# Altium schematic sheet USB.SchDoc
size A3; PageSetup: Record=PageOptions|CenterHorizontal=True|CenterVertical=True|PrintScale=1.00|XCorrection=1.00|YCorrection=1.00|PrintKind=0|BorderSize=5000000|LeftOffset=0|BottomOffset=0|Orientation=2|PaperLength=1000|PaperWidth=1000|Scale=100|PaperSource=7|PrintQuality=-4|MediaType=1|DitherType=10|PaperKind=A4|PrintScaleMode=1; Organization: Electronic Research & Design; Address1: 11 Granofier; Address2: Zwartkop; Address3: Centurion; Address4: South Africa
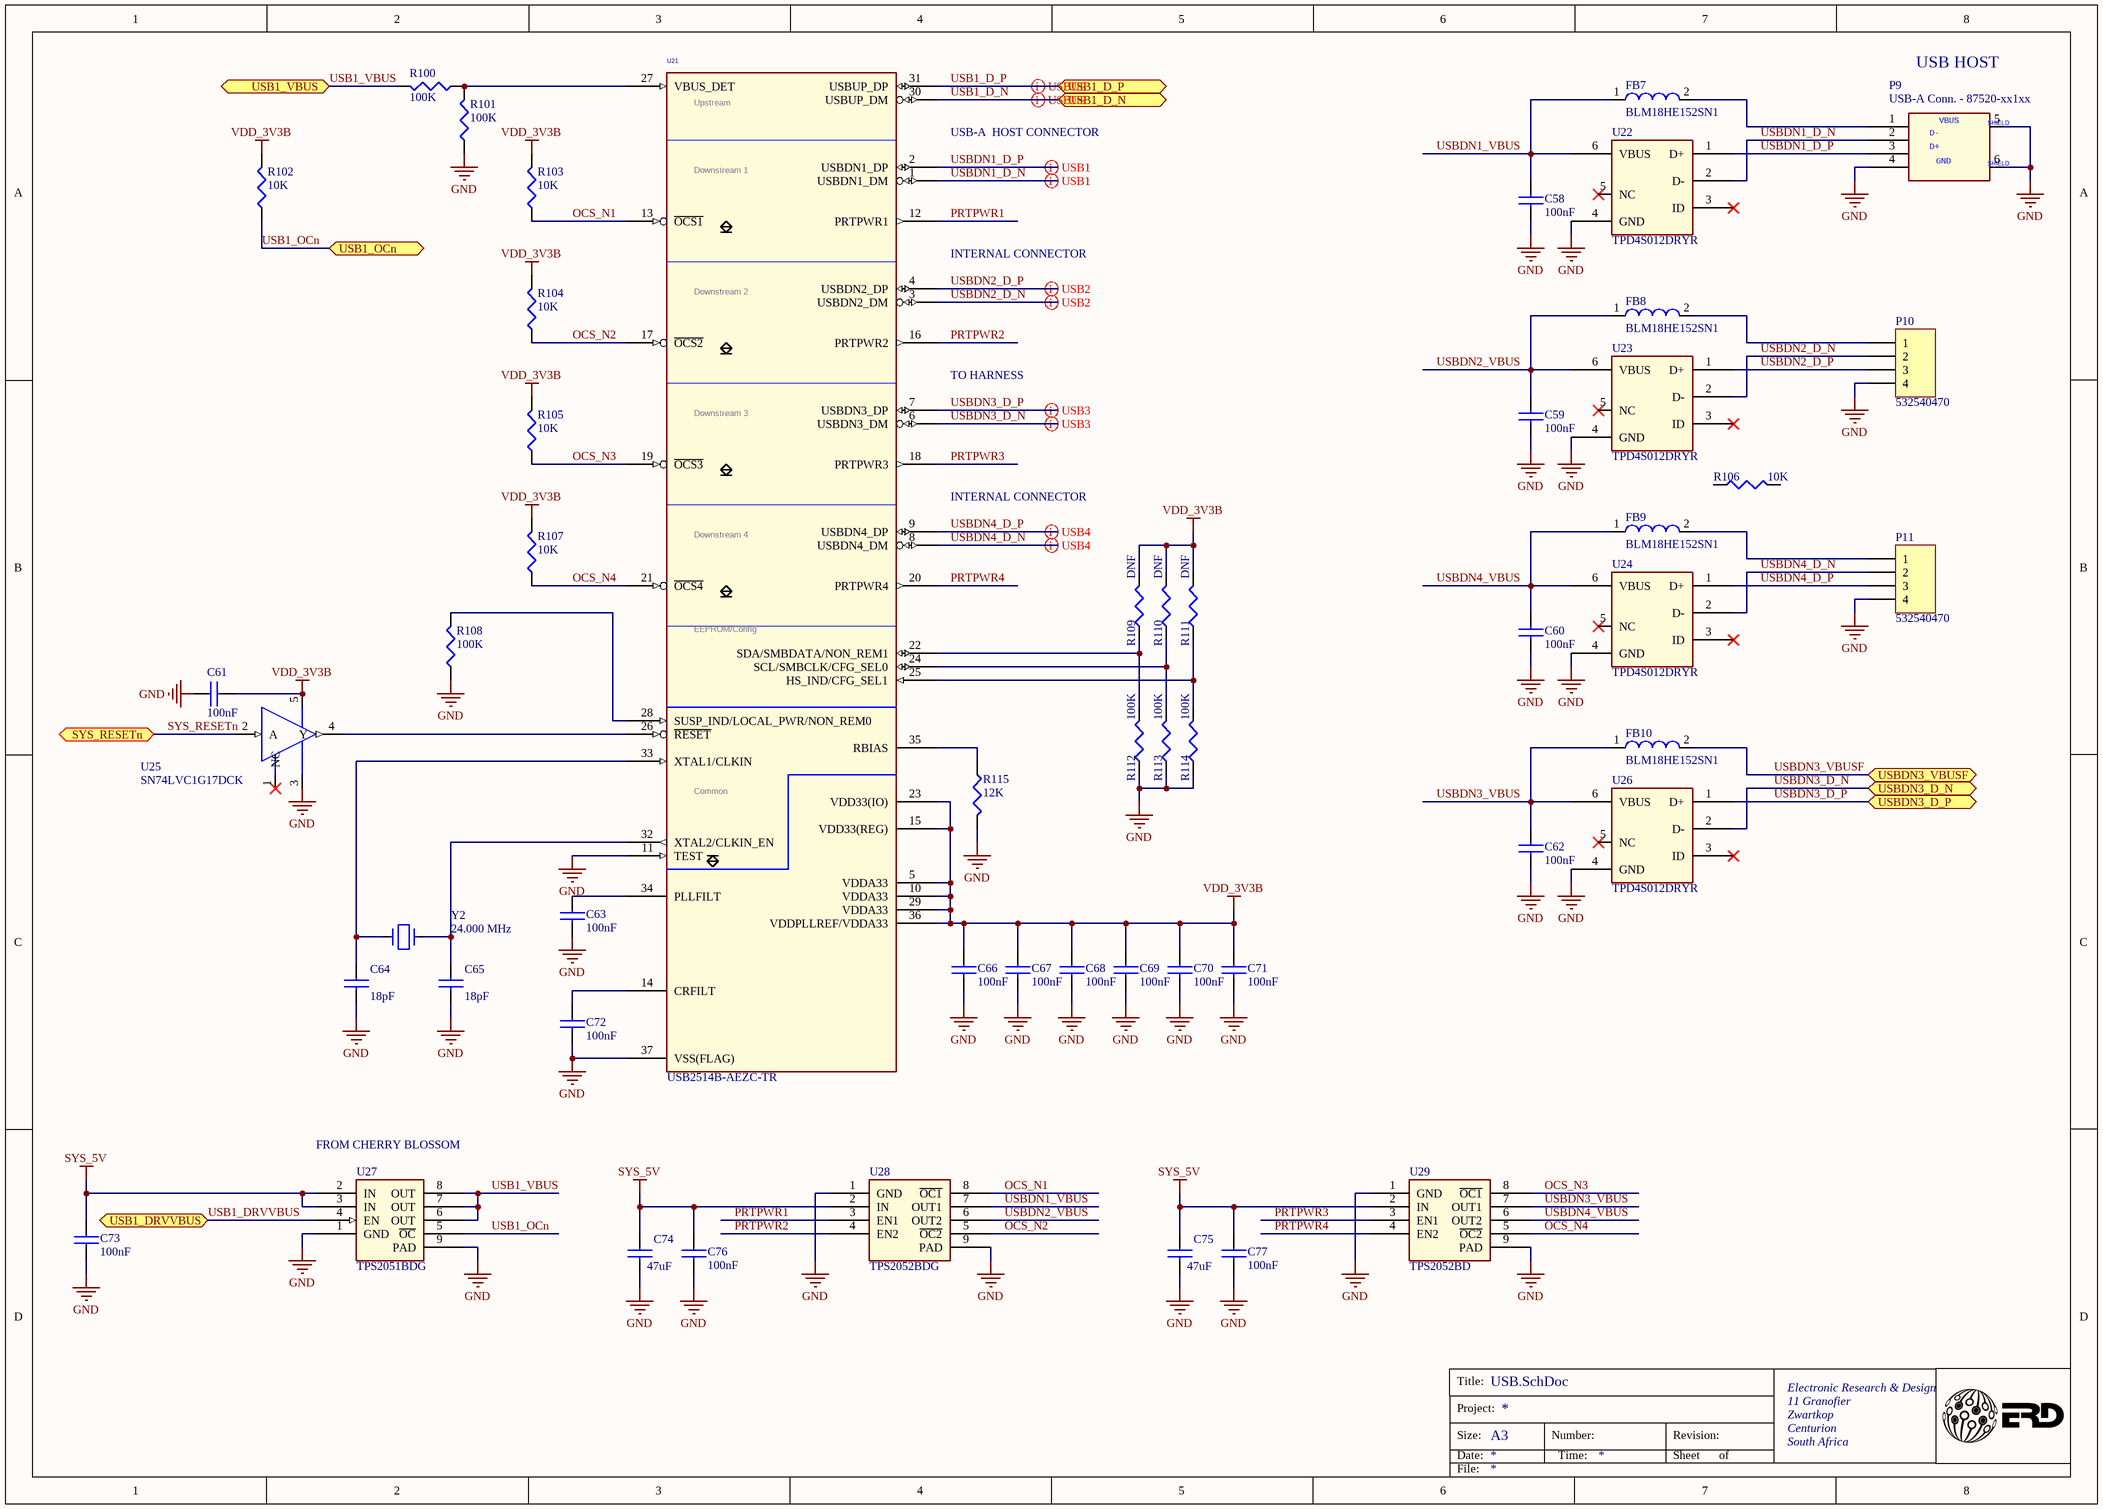
[diagram p0: USB.SchDoc]

## Parts
C58  100nF  [CC0402]
C59  100nF  [CC0402]
C60  100nF  [CC0402]
C61  100nF  [CC0402]
C62  100nF  [CC0402]
C63  100nF  [CC0402]
C64  18pF  [CC0402]
C65  18pF  [CC0402]
C66  100nF  [CC0402]
C67  100nF  [CC0402]
C68  100nF  [CC0402]
C69  100nF  [CC0402]
C70  100nF  [CC0402]
C71  100nF  [CC0402]
C72  100nF  [CC0402]
C73  100nF  [CC0402]
C74  47uF  [RC1206]
C75  47uF  [RC1206]
C76  100nF  [CC0402]
C77  100nF  [CC0402]
FB7  BLM18HE152SN1  [LC0603]
FB8  BLM18HE152SN1  [LC0603]
FB9  BLM18HE152SN1  [LC0603]
FB10  BLM18HE152SN1  [LC0603]
P9  USB-A Conn. - 87520-xx1xx  [usb_a_sh]
P10  532540470  [HDR1X4]
P11  532540470  [HDR1X4]
R100  100K  [RC0402]
R101  100K  [RC0402]
R102  10K  [RC0402]
R103  10K  [RC0402]
R104  10K  [RC0402]
R105  10K  [RC0402]
R106  10K  [RC0402]
R107  10K  [RC0402]
R108  100K  [RC0402]
R109  DNF  [RC0402]
R110  DNF  [RC0402]
R111  DNF  [RC0402]
R112  100K  [RC0402]
R113  100K  [RC0402]
R114  100K  [RC0402]
R115  12K  [RC0402]
U21  USB2514B-AEZC-TR  [SQFN-36]
U22  TPD4S012DRYR  [U_6_DRY]
U23  TPD4S012DRYR  [U_6_DRY]
U24  TPD4S012DRYR  [U_6_DRY]
U25  SN74LVC1G17DCK  [DCK5_2P15X1P4]
U26  TPD4S012DRYR  [U_6_DRY]
U27  TPS2051BDG  [DGN-16X60]
U28  TPS2052BDG  [DGN-16X60]
U29  TPS2052BD  [DGN-16X60]
Y2  24.000 MHz  [XTAL150SMD_125X196]

## Ports
SYS_RESETn, USB1_D_N, USB1_D_P, USB1_DRVVBUS, USB1_OCn, USB1_VBUS, USBDN3_D_N, USBDN3_D_P, USBDN3_VBUSF

## Nets
GND: C58.2 C59.2 C60.2 C61.1 C62.2 C63.2 C64.2 C65.2 C66.2 C67.2 C68.2 C69.2 C70.2 C71.2 C72.2 C73.2 C74.2 C75.2 C76.2 C77.2 P9.4(P4) P9.5(SHELD1) P9.6(PAD4) P10.4 P11.4 R101.1 R108.1 R112.1 R113.1 R114.1 R115.2 U21.11(TEST) U21.37(VSS(FLAG)) U22.4(GND) U23.4(GND) U24.4(GND) U25.3(GND) U26.4(GND) U27.1(GND) U27.9(PAD) U28.1(GND) U28.9(PAD) U29.1(GND) U29.9(PAD)
SYS_5V: C73.1 C74.1 C75.1 C76.1 C77.1 U27.2(IN) U27.3(IN) U28.2(IN) U29.2(IN)
VDD_3V3B: C61.2 C66.1 C67.1 C68.1 C69.1 C70.1 C71.1 R102.2 R103.2 R104.2 R105.2 R107.2 R109.2 R110.2 R111.2 U21.5(VDDA33) U21.10(VDDA33) U21.15(VDD33(REG)) U21.23(VDD33(IO)) U21.29(VDDA33) U21.36(VDDPLLREF/VDDA33) U25.5(VCC)
OCS_N1: R103.1 U21.13(~{OCS1}) U28.8(~{OC1})
OCS_N2: R104.1 U21.17(~{OCS2}) U28.5(~{OC2})
OCS_N3: R105.1 U21.19(~{OCS3}) U29.8(~{OC1})
OCS_N4: R107.1 U21.21(~{OCS4}) U29.5(~{OC2})
PRTPWR1: U21.12(PRTPWR1) U28.3(EN1)
PRTPWR2: U21.16(PRTPWR2) U28.4(EN2)
PRTPWR3: U21.18(PRTPWR3) U29.3(EN1)
PRTPWR4: U21.20(PRTPWR4) U29.4(EN2)
SYS_RESETn: U25.2(A) ; port SYS_RESETn
USB1_D_N: U21.30(USBUP_DM) ; port USB1_D_N
USB1_D_P: U21.31(USBUP_DP) ; port USB1_D_P
USB1_DRVVBUS: U27.4(EN) ; port USB1_DRVVBUS
USB1_OCn: R102.1 U27.5(~{OC}) ; port USB1_OCn
USB1_VBUS: R100.2 U27.6(OUT) U27.7(OUT) U27.8(OUT) ; port USB1_VBUS
USBDN1_D_N: P9.2(P2) U21.1(USBDN1_DM) U22.2(D-)
USBDN1_D_P: P9.3(P3) U21.2(USBDN1_DP) U22.1(D+)
USBDN1_VBUS: C58.1 FB7.1 U22.6(VBUS) U28.7(OUT1)
USBDN2_D_N: P10.2 U21.3(USBDN2_DM) U23.2(D-)
USBDN2_D_P: P10.3 U21.4(USBDN2_DP) U23.1(D+)
USBDN2_VBUS: C59.1 FB8.1 U23.6(VBUS) U28.6(OUT2)
USBDN3_D_N: U21.6(USBDN3_DM) U26.2(D-) ; port USBDN3_D_N
USBDN3_D_P: U21.7(USBDN3_DP) U26.1(D+) ; port USBDN3_D_P
USBDN3_VBUS: C62.1 FB10.1 U26.6(VBUS) U29.7(OUT1)
USBDN3_VBUSF: FB10.2 ; port USBDN3_VBUSF
USBDN4_D_N: P11.2 U21.8(USBDN4_DM) U24.2(D-)
USBDN4_D_P: P11.3 U21.9(USBDN4_DP) U24.1(D+)
USBDN4_VBUS: C60.1 FB9.1 U24.6(VBUS) U29.6(OUT2)
NetC63_1: C63.1 U21.34(PLLFILT)
NetC64_1: C64.1 U21.33(XTAL1/CLKIN) Y2.1
NetC65_1: C65.1 U21.32(XTAL2/CLKIN_EN) Y2.2
NetC72_1: C72.1 U21.14(CRFILT)
NetFB7_2: FB7.2 P9.1(P1)
NetFB8_2: FB8.2 P10.1
NetFB9_2: FB9.2 P11.1
NetR100_1: R100.1 R101.2 U21.27(VBUS_DET)
NetR108_2: R108.2 U21.28(SUSP_IND/LOCAL_PWR/NON_REM0)
NetR109_1: R109.1 R112.2 U21.22(SDA/SMBDATA/NON_REM1)
NetR110_1: R110.1 R113.2 U21.24(SCL/SMBCLK/CFG_SEL0)
NetR111_1: R111.1 R114.2 U21.25(HS_IND/CFG_SEL1)
NetR115_1: R115.1 U21.35(RBIAS)
NetU21_26: U21.26(~{RESET}) U25.4(Y)

Not connected (* = marked no-connect by the designer): R106 1 2; U22 3(ID)* 5(NC)*; U23 3(ID)* 5(NC)*; U24 3(ID)* 5(NC)*; U25 1(NC)*; U26 3(ID)* 5(NC)*

## Layout directives
differential pair: USB1_D_N, USB1_D_P, USBDN1_D_N, USBDN1_D_P, USBDN2_D_N, USBDN2_D_P, USBDN3_D_N, USBDN3_D_P, USBDN4_D_N, USBDN4_D_P

## Notes on the sheet
- USB HOST
- USB-A  HOST CONNECTOR
- INTERNAL CONNECTOR
- TO HARNESS
- (near U27) FROM CHERRY BLOSSOM
- Title:
- Size:
- Date:
- Project:
- A3
- Number:
- Time:
- Revision:
- Sheet
- of
- File:
- (in symbol CONN_54819-0578_2) VBUS; SHIELD; D-; D+; GND
- (in symbol USB2514B_QFN36_MIN) Upstream; Downstream 1; Downstream 2; Downstream 3; Downstream 4; EEPROM/Config; Common

## Library data of the parts
C58-C63 C66-C73 C76 C77 = CAP CER 0.1UF 10V 10% X5R 0402: CAP CER 0.1UF 50V 10% X7R 0402; Manufacturer: Murata; PartNumber: GCM155R71H104KE02D; Package / Case: 0402 (1005 Metric); Supplier: AAD
C64 C65 = CAP CER 2.2UF 6.3V 10% X5R 0402: CAP CER 18pF 50V 5% C0G 0402; Manufacturer: AVX; PartNumber: GJM1555C1H180FB01D; Package / Case: 0402 (1005 Metric); Supplier: AAD; Supplier Stock Code: N/A
C74 C75 = CAP CER 0.1UF 10V 10% X5R 0402: CAP CER 47UF 25V 20% X5R 1206; Manufacturer: Murata; Part Number: C3216X5R1E476M160AC; Package / Case: 1206; Voltage Rating: 25v
FB7-FB10 = FER_180_200_0: FERRITE, 500mA, 500mOHM, 0603; PartNumber: BLM18HE152SN1
P9 = CONN_54819-0578_2: CONN RCPT USB TYPE A R/A PCB; Manufacturer: FCI; Manufacturer Part Number: 87520-0010BLF; CLASS: IO; TN: 224-0234-000; Number of Contacts: 4; Gender: Receptacle; Specifications: USB 2.0; Supplier 1: Digi-Key; Supplier Part Number 1: 609-1045-ND; RoHS: RoHS Compliant; Category: Connectors, Interconnects; Stock 1: 4363; Pricing 1: 1=0.78, 10=0.734, 25=0.6604, 50=0.587, 100=0.5626, 250=0.51368, 500=0.4892, 1000=0.40359, 2500=0.3669 (USD); Connector Type: USB - A; Mounting Type: Through Hole, Right Angle, Horizontal; Features: Board Lock; Packaging: Tube; Ingress Protection: -; ComponentLink1URL: http://portal.fciconnect.com/Comergent//fci/drawing/87520.pdf; ComponentLink1Description: http://portal.fciconnect.com/Comergent//fci/drawing/87520.pdf
P10 P11 = Header 4: Header, RA, 4-circuit, 2mm pitch, TH; Manufacturer: Molex; PartNumber: 532540470
R100 R101 R108 R112-R114 = RES_10K_1/16W_1%_0402: RES, 100K OHM, 1/16W, 1%, 0402; Manufacturer: Yageo; Part Number: RC0402FR-07100KL; Package / Case: 0402 (1005 Metric); Supplier: AAD
R102-R107 R109-R111 = RES_10K_1/16W_1%_0402: RES, 10K OHM, 1/16W, 1%, 0402; Manufacturer: Yageo; Part Number: RC0402FR-0710KL; Package / Case: 0402 (1005 Metric); Supplier: AAD
R115 = RES_10K_1/16W_1%_0402: RES, 12K OHM, 1/16W, 1%, 0402; Manufacturer: Yageo; Part Number: RC0402FR-0712KL; Package / Case: 0402 (1005 Metric); Supplier: AAD
U21 = USB2514B_QFN36_MIN: IC, USB2514B, 4 Port USB 2.0 Hub w/ Battery Chg, QFN36; Mfg1_PN: USB2514B-AEZG; Mfg1: SMSC; Cost_Reel: 0; DNP: No; Device: USB2514BQFN36; Cost: 0; Cost_1K: 0; Cost_100: 0
U22-U24 U26 = PROT_TPD4S012: ESD 4channel USB Interface; Manufacturer: Texas Instruments; PartNumber: TPD4S012DRYR; Package / Case: 6-UFDFN; Supplier: AAD; Supplier Stock Code: N/A
U25 = SN74LVC1G17DCK: IC Buffer SINGLE 1INPUT SC70-5; Manufacturer: Texas Instruments; Supplier: AAD; Supplier Stock Code: N/A; PartNumber: SN74LVC1G17DCK
U27 = TPS2061_0: IC 1.5A PWR DIST SWITCH 8-MSOP; Manufacturer: Texas Instruments; Number of Outputs: 1; Rds (On): 135 mOhm; Internal Switch(s): Yes; Current Limit: 1A; Voltage - Input: 2.7 V ~ 5.5 V; Supplier 1: Digi-Key; Supplier Part Number 1: 296-17313-6-ND; PartNumber: TPS2051BDG; RoHS: RoHS Compliant; Category: Integrated Circuits (ICs); Stock 1: 7065; Pricing 1: 1=1.82, 10=1.642, 25=1.4708, 100=1.3224, 250=1.1742, 500=1.026, 1000=0.8493 (USD); Type: High Side Switch; Operating Temperature: -40°C ~ 85°C; Mounting Type: Surface Mount; Package / Case: 8-TSSOP, 8-MSOP (0.118", 3.00mm Width) Exposed Pad; Supplier Device Package: 8-MSOP-PowerPad; Packaging: Digi-Reel®; ComponentLink1URL: http://www.ti.com/lit/ds/symlink/tps2051b.pdf; ComponentLink1Description: http://www.ti.com/lit/ds/symlink/tps2051b.pdf
U28 U29 = TPS2052: IC 0.7A PWR DIST SWITCH 8-MSOP; AltPartNumber: MP6231DH
  U28: PartNumber: TPS2052BDG
  U29: PartNumber: TPS2052BD
Y2 = 458: Crystal, 24 MHz, 20ppm, 2-SMD; PartNumber: ABM3-24.000MHZ-B2-T; Specification: 0.197" L x 0.126" W (5.00mm x 3.20mm); Value: 24.000 MHz